# Altium schematic sheet Thruster_rev2 (1).SchDoc
size A; SheetNumber: 4; SheetTotal: 4
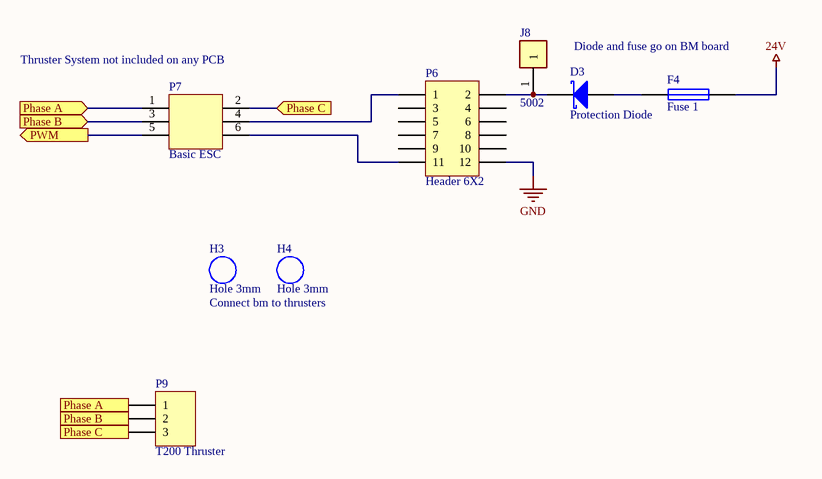
[diagram p0: Thruster_rev2 (1).SchDoc]

## Parts
D3  Protection Diode  [TO-220AC]
F4  Fuse 1  [PIN-W2/E2.8]
H3  Hole 3mm  [Hole 3mm]
H4  Hole 3mm  [Hole 3mm]
J8  5002  [KEYSTONE_5002]
P6  Header 6X2  [HDR2X6]
P7  Basic ESC  [HDR2X3]
P9  T200 Thruster  [HDR1X3]

## Ports
Phase A (in), Phase A (out), Phase B (in), Phase B (out), Phase C (in), Phase C (out), PWM (out)

## Nets
24V: F4.1
GND: P6.12
Phase A: P7.1(Phase_A) P9.1 ; port Phase A
Phase B: P7.3(Phase_C) P9.2 ; port Phase B
Phase C: P7.2(Phase_B) P9.3 ; port Phase C
PWM: P7.5(PWM) ; port PWM
NetD3_1: D3.1(K) J8.1 P6.2
NetD3_3: D3.3(A) F4.2
NetP6_1: P6.1 P7.4(V+)
NetP6_11: P6.11 P7.6(GND)

Not connected (* = marked no-connect by the designer): P6 3 4 5 6 7 8 9 10

## Notes on the sheet
- (near P7) Thruster System not included on any PCB
- Diode and fuse go on BM board
- Connect bm to thrusters

## Library data of the parts
D3 = Diode 10TQ035: Schottky Rectifier; Note: Terminal 2 is the TAB and is electrically connected to the cathode; Published: 8-Jun-2000; LatestRevisionDate: 17-Jul-2002; LatestRevisionNote: Re-released for DXP Platform.; DatasheetVersion: PD-2.057B; PackageVersion: Feb-1998; PackageReference: TO-220AC; Publisher: Altium Limited; PackageDescription: TO, Thru-Hole, Vertical, Heatsink Mounted; 3 In-Line Leads (1 Absent); Pitch 2.54 mm; ComponentLink1Description: Manufacturer Link; ComponentLink1URL: http://www.irf.com/; ComponentLink2Description: Datasheet; ComponentLink2URL: http://www.irf.com/product-info/datasheets/data/10tq.pdf
F4 = Fuse 1: Fuse; Published: 8-Jun-2000; LatestRevisionDate: 17-Jul-2002; LatestRevisionNote: Re-released for DXP Platform.; PackageReference: PIN-W2/E2.8; Publisher: Altium Limited; PackageDescription: Thru-Hole; 2 Leads
J8 = 5002: 2.2ÂµH Shielded Wirewound Inductor 1.8A 66mOhm Max Nonstandard; MF: Keystone Electronics; Price: None; MP: 5002; Availability: Unavailable; SnapEDA_Link: https://www.snapeda.com/parts/5002/Keystone%20Electronics/view-part/500797/?ref=snap; Value: *; Mouser-Purchase-URL: https://snapeda.com/shop?store=Mouser&id=500797; Package: Test Point Keystone Electronics
P6 = Header 6X2: 2x6 position wire screw connector block; LatestRevisionDate: 17-Jul-2002; LatestRevisionNote: Re-released for DXP Platform.; Publisher: Altium Limited
P7 = Header 3X2: LatestRevisionDate: 17-Jul-2002; LatestRevisionNote: Re-released for DXP Platform.; Publisher: Altium Limited
P9 = Header 3: Header, 3-Pin; LatestRevisionDate: 17-Jul-2002; LatestRevisionNote: Re-released for DXP Platform.; Publisher: Altium Limited